# Altium schematic sheet Mosfet_Board.SchDoc
size A4; SheetNumber: 5; SheetTotal: 8
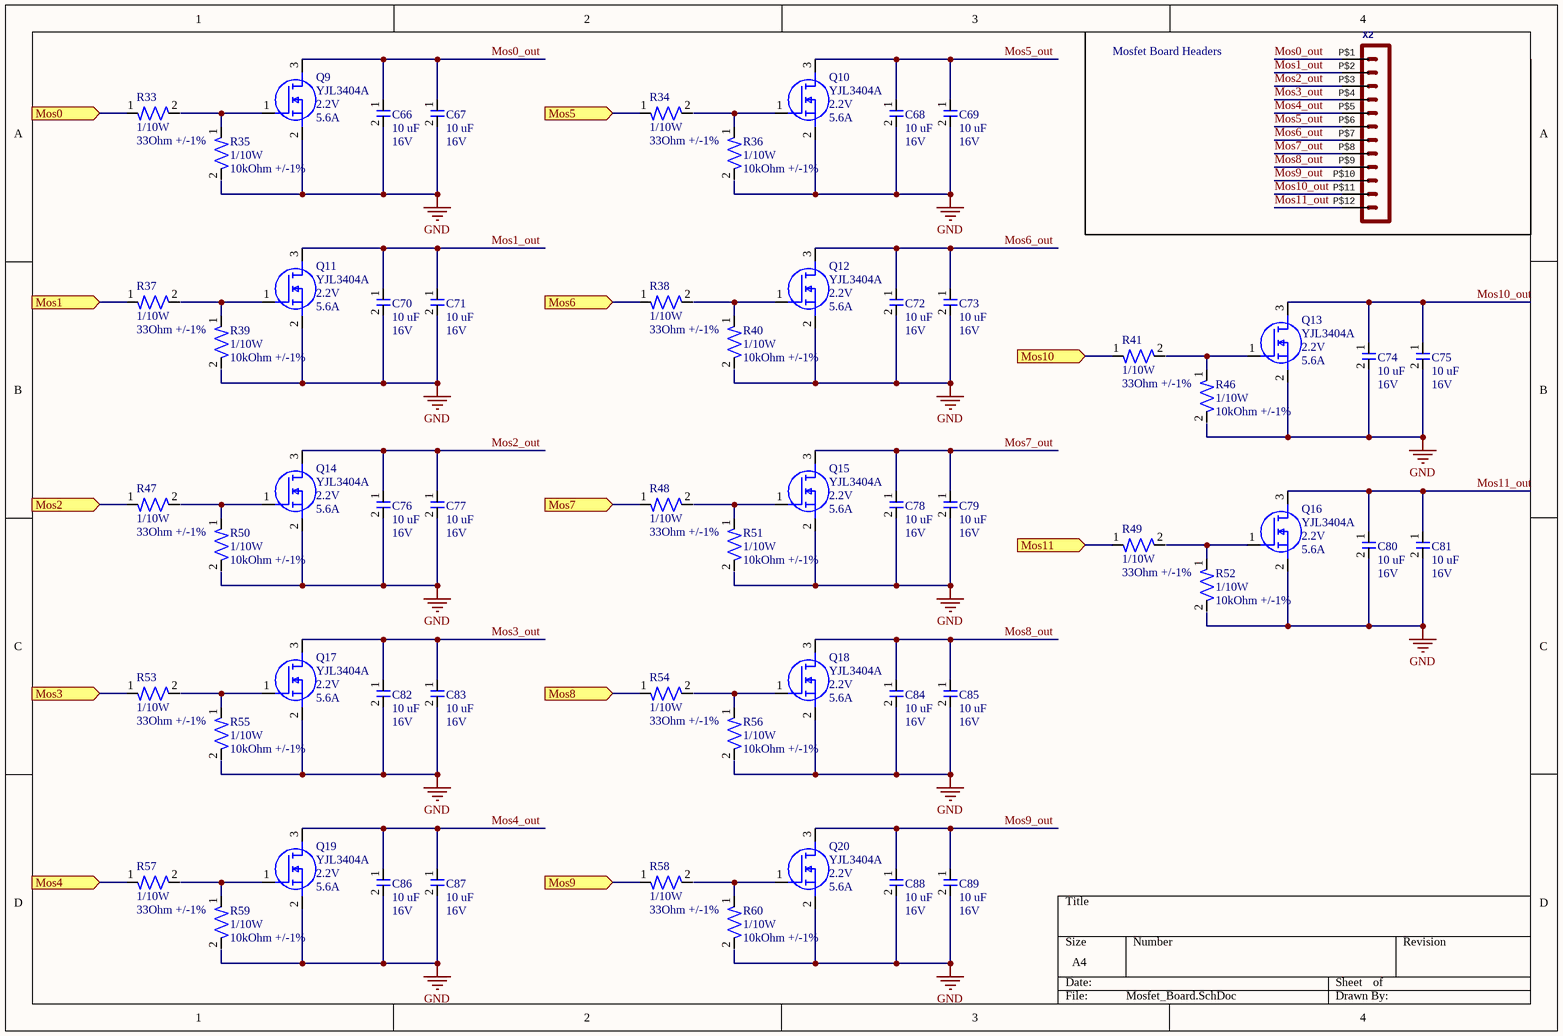
[diagram p0: Mosfet_Board.SchDoc]

## Parts
C66  Capacitance: 10 uF  Voltage Rating: 16V  [CAP-0805]  (hidden comment: MCS1802GS-20-Z)
C67  Capacitance: 10 uF  Voltage Rating: 16V  [CAP-0805]  (hidden comment: MCS1802GS-20-Z)
C68  Capacitance: 10 uF  Voltage Rating: 16V  [CAP-0805]  (hidden comment: MCS1802GS-20-Z)
C69  Capacitance: 10 uF  Voltage Rating: 16V  [CAP-0805]  (hidden comment: MCS1802GS-20-Z)
C70  Capacitance: 10 uF  Voltage Rating: 16V  [CAP-0805]  (hidden comment: MCS1802GS-20-Z)
C71  Capacitance: 10 uF  Voltage Rating: 16V  [CAP-0805]  (hidden comment: MCS1802GS-20-Z)
C72  Capacitance: 10 uF  Voltage Rating: 16V  [CAP-0805]  (hidden comment: MCS1802GS-20-Z)
C73  Capacitance: 10 uF  Voltage Rating: 16V  [CAP-0805]  (hidden comment: MCS1802GS-20-Z)
C74  Capacitance: 10 uF  Voltage Rating: 16V  [CAP-0805]  (hidden comment: MCS1802GS-20-Z)
C75  Capacitance: 10 uF  Voltage Rating: 16V  [CAP-0805]  (hidden comment: MCS1802GS-20-Z)
C76  Capacitance: 10 uF  Voltage Rating: 16V  [CAP-0805]  (hidden comment: MCS1802GS-20-Z)
C77  Capacitance: 10 uF  Voltage Rating: 16V  [CAP-0805]  (hidden comment: MCS1802GS-20-Z)
C78  Capacitance: 10 uF  Voltage Rating: 16V  [CAP-0805]  (hidden comment: MCS1802GS-20-Z)
C79  Capacitance: 10 uF  Voltage Rating: 16V  [CAP-0805]  (hidden comment: MCS1802GS-20-Z)
C80  Capacitance: 10 uF  Voltage Rating: 16V  [CAP-0805]  (hidden comment: MCS1802GS-20-Z)
C81  Capacitance: 10 uF  Voltage Rating: 16V  [CAP-0805]  (hidden comment: MCS1802GS-20-Z)
C82  Capacitance: 10 uF  Voltage Rating: 16V  [CAP-0805]  (hidden comment: MCS1802GS-20-Z)
C83  Capacitance: 10 uF  Voltage Rating: 16V  [CAP-0805]  (hidden comment: MCS1802GS-20-Z)
C84  Capacitance: 10 uF  Voltage Rating: 16V  [CAP-0805]  (hidden comment: MCS1802GS-20-Z)
C85  Capacitance: 10 uF  Voltage Rating: 16V  [CAP-0805]  (hidden comment: MCS1802GS-20-Z)
C86  Capacitance: 10 uF  Voltage Rating: 16V  [CAP-0805]  (hidden comment: MCS1802GS-20-Z)
C87  Capacitance: 10 uF  Voltage Rating: 16V  [CAP-0805]  (hidden comment: MCS1802GS-20-Z)
C88  Capacitance: 10 uF  Voltage Rating: 16V  [CAP-0805]  (hidden comment: MCS1802GS-20-Z)
C89  Capacitance: 10 uF  Voltage Rating: 16V  [CAP-0805]  (hidden comment: MCS1802GS-20-Z)
Q9  YJL3404A  Vgs(th): 2.2V  Drain Current: 5.6A  [NMOS-SOT23-3]
Q10  YJL3404A  Vgs(th): 2.2V  Drain Current: 5.6A  [NMOS-SOT23-3]
Q11  YJL3404A  Vgs(th): 2.2V  Drain Current: 5.6A  [NMOS-SOT23-3]
Q12  YJL3404A  Vgs(th): 2.2V  Drain Current: 5.6A  [NMOS-SOT23-3]
Q13  YJL3404A  Vgs(th): 2.2V  Drain Current: 5.6A  [NMOS-SOT23-3]
Q14  YJL3404A  Vgs(th): 2.2V  Drain Current: 5.6A  [NMOS-SOT23-3]
Q15  YJL3404A  Vgs(th): 2.2V  Drain Current: 5.6A  [NMOS-SOT23-3]
Q16  YJL3404A  Vgs(th): 2.2V  Drain Current: 5.6A  [NMOS-SOT23-3]
Q17  YJL3404A  Vgs(th): 2.2V  Drain Current: 5.6A  [NMOS-SOT23-3]
Q18  YJL3404A  Vgs(th): 2.2V  Drain Current: 5.6A  [NMOS-SOT23-3]
Q19  YJL3404A  Vgs(th): 2.2V  Drain Current: 5.6A  [NMOS-SOT23-3]
Q20  YJL3404A  Vgs(th): 2.2V  Drain Current: 5.6A  [NMOS-SOT23-3]
R33  Power Rating: 1/10W  Resistance: 33Ohm +/-1%  [RES-0603]  (hidden comment: RC0603FR-0733RP)
R34  Power Rating: 1/10W  Resistance: 33Ohm +/-1%  [RES-0603]  (hidden comment: RC0603FR-0733RP)
R35  Power Rating: 1/10W  Resistance: 10kOhm +/-1%  [RES-0603]  (hidden comment: RC0603FR-0710KP)
R36  Power Rating: 1/10W  Resistance: 10kOhm +/-1%  [RES-0603]  (hidden comment: RC0603FR-0710KP)
R37  Power Rating: 1/10W  Resistance: 33Ohm +/-1%  [RES-0603]  (hidden comment: RC0603FR-0733RP)
R38  Power Rating: 1/10W  Resistance: 33Ohm +/-1%  [RES-0603]  (hidden comment: RC0603FR-0733RP)
R39  Power Rating: 1/10W  Resistance: 10kOhm +/-1%  [RES-0603]  (hidden comment: RC0603FR-0710KP)
R40  Power Rating: 1/10W  Resistance: 10kOhm +/-1%  [RES-0603]  (hidden comment: RC0603FR-0710KP)
R41  Power Rating: 1/10W  Resistance: 33Ohm +/-1%  [RES-0603]  (hidden comment: RC0603FR-0733RP)
R46  Power Rating: 1/10W  Resistance: 10kOhm +/-1%  [RES-0603]  (hidden comment: RC0603FR-0710KP)
R47  Power Rating: 1/10W  Resistance: 33Ohm +/-1%  [RES-0603]  (hidden comment: RC0603FR-0733RP)
R48  Power Rating: 1/10W  Resistance: 33Ohm +/-1%  [RES-0603]  (hidden comment: RC0603FR-0733RP)
R49  Power Rating: 1/10W  Resistance: 33Ohm +/-1%  [RES-0603]  (hidden comment: RC0603FR-0733RP)
R50  Power Rating: 1/10W  Resistance: 10kOhm +/-1%  [RES-0603]  (hidden comment: RC0603FR-0710KP)
R51  Power Rating: 1/10W  Resistance: 10kOhm +/-1%  [RES-0603]  (hidden comment: RC0603FR-0710KP)
R52  Power Rating: 1/10W  Resistance: 10kOhm +/-1%  [RES-0603]  (hidden comment: RC0603FR-0710KP)
R53  Power Rating: 1/10W  Resistance: 33Ohm +/-1%  [RES-0603]  (hidden comment: RC0603FR-0733RP)
R54  Power Rating: 1/10W  Resistance: 33Ohm +/-1%  [RES-0603]  (hidden comment: RC0603FR-0733RP)
R55  Power Rating: 1/10W  Resistance: 10kOhm +/-1%  [RES-0603]  (hidden comment: RC0603FR-0710KP)
R56  Power Rating: 1/10W  Resistance: 10kOhm +/-1%  [RES-0603]  (hidden comment: RC0603FR-0710KP)
R57  Power Rating: 1/10W  Resistance: 33Ohm +/-1%  [RES-0603]  (hidden comment: RC0603FR-0733RP)
R58  Power Rating: 1/10W  Resistance: 33Ohm +/-1%  [RES-0603]  (hidden comment: RC0603FR-0733RP)
R59  Power Rating: 1/10W  Resistance: 10kOhm +/-1%  [RES-0603]  (hidden comment: RC0603FR-0710KP)
R60  Power Rating: 1/10W  Resistance: 10kOhm +/-1%  [RES-0603]  (hidden comment: RC0603FR-0710KP)
X2  Molex - Micro-Fit 3.0 Series connector,  3.00mm (0.118") pitch header, 12 positions.  [44764-1201]  (value not drawn)

## Ports
Mos0 (in), Mos1 (in), Mos2 (in), Mos3 (in), Mos4 (in), Mos5 (in), Mos6 (in), Mos7 (in), Mos8 (in), Mos9 (in), Mos10 (in), Mos11 (in)

## Nets
GND: C66.2 C67.2 C68.2 C69.2 C70.2 C71.2 C72.2 C73.2 C74.2 C75.2 C76.2 C77.2 C78.2 C79.2 C80.2 C81.2 C82.2 C83.2 C84.2 C85.2 C86.2 C87.2 C88.2 C89.2 Q9.2(S) Q10.2(S) Q11.2(S) Q12.2(S) Q13.2(S) Q14.2(S) Q15.2(S) Q16.2(S) Q17.2(S) Q18.2(S) Q19.2(S) Q20.2(S)
Mos0: R33.1 ; port Mos0
Mos0_out: C66.1 C67.1 Q9.3(D) X2.P$1
Mos1: R37.1 ; port Mos1
Mos1_out: C70.1 C71.1 Q11.3(D) X2.P$2
Mos2: R47.1 ; port Mos2
Mos2_out: C76.1 C77.1 Q14.3(D) X2.P$3
Mos3: R53.1 ; port Mos3
Mos3_out: C82.1 C83.1 Q17.3(D) X2.P$4
Mos4: R57.1 ; port Mos4
Mos4_out: C86.1 C87.1 Q19.3(D) X2.P$5
Mos5: R34.1 ; port Mos5
Mos5_out: C68.1 C69.1 Q10.3(D) X2.P$6
Mos6: R38.1 ; port Mos6
Mos6_out: C72.1 C73.1 Q12.3(D) X2.P$7
Mos7: R48.1 ; port Mos7
Mos7_out: C78.1 C79.1 Q15.3(D) X2.P$8
Mos8: R54.1 ; port Mos8
Mos8_out: C84.1 C85.1 Q18.3(D) X2.P$9
Mos9: R58.1 ; port Mos9
Mos9_out: C88.1 C89.1 Q20.3(D) X2.P$10
Mos10: R41.1 ; port Mos10
Mos10_out: C74.1 C75.1 Q13.3(D) X2.P$11
Mos11: R49.1 ; port Mos11
Mos11_out: C80.1 C81.1 Q16.3(D) X2.P$12
NetQ9_1: Q9.1(G) R35.1
NetQ10_1: Q10.1(G) R36.1
NetQ11_1: Q11.1(G) R39.1
NetQ12_1: Q12.1(G) R40.1
NetQ13_1: Q13.1(G) R46.1
NetQ14_1: Q14.1(G) R50.1
NetQ15_1: Q15.1(G) R51.1
NetQ16_1: Q16.1(G) R52.1
NetQ17_1: Q17.1(G) R55.1
NetQ18_1: Q18.1(G) R56.1
NetQ19_1: Q19.1(G) R59.1
NetQ20_1: Q20.1(G) R60.1

Not connected (* = marked no-connect by the designer): R33 2; R34 2; R35 2; R36 2; R37 2; R38 2; R39 2; R40 2; R41 2; R46 2; R47 2; R48 2; R49 2; R50 2; R51 2; R52 2; R53 2; R54 2; R55 2; R56 2; R57 2; R58 2; R59 2; R60 2

## Notes on the sheet
- Mosfet Board Headers

## Library data of the parts
C66-C89 = CAP-10U-0002: 10 µF ±10% 16V Ceramic Capacitor X7R 0805 (2012 Metric); Package Size: 0805
Q9-Q20 = NMOS-5.6A-0001: N-Channel 30 V 5.6A (Ta) 1.2W (Ta) Surface Mount SOT-23; Vdss: 30V; Rds On: 24 mOhm; Manufacturer Part Number: YJL3404A; Package Size: SOT23
R33 R34 R37 R38 R41 R47-R49 R53 R54 R57 R58 = RES-33-0002: RES SMD 33 OHM 1% 1/10W 0603; Manufacturer: YAGEO; Assembled?: no; Manufacturer Part Number: RC0603FR-0733RP; Package Size: 0603
R35 R36 R39 R40 R46 R50-R52 R55 R56 R59 R60 = RES-10K-0002: RES SMD 10K OHM 1% 1/10W 0603; Manufacturer: YAGEO; Assembled?: no; Manufacturer Part Number: RC0603FR-0710KP; Package Size: 0603
X2 = HEADER_POS12_?44764-1201: GateName_1: G$1; SymbolName_1: HEADER_POS12; DeviceName: 44764-1201; LibraryName: con-molex-micro-fit-3_0_2; DeviceSetName: HEADER_POS12_?; Package: 44764-1201